# Altium schematic sheet Counter.SchDoc
size A4
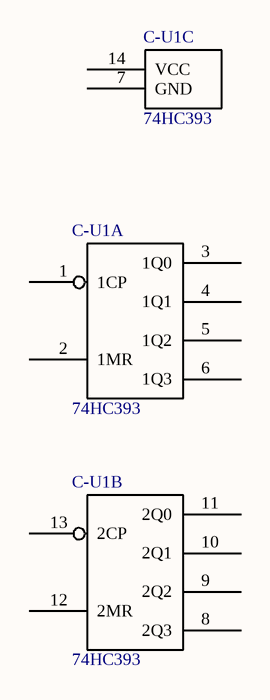
[diagram p0: Counter.SchDoc]

## Parts
C-U1  74HC393  [SOIC-14]  (parts A,B,C of 3)

## Nets

Not connected (* = marked no-connect by the designer): C-U1 1(1CP) 2(1MR) 3(1Q0) 4(1Q1) 5(1Q2) 6(1Q3) 7(GND) 8(2Q3) 9(2Q2) 10(2Q1) 11(2Q0) 12(2MR) 13(2CP) 14(VCC)

## Library data of the parts
C-U1 = 74HC393: Dual 4-Bit Counter